# Altium schematic sheet Charger.SchDoc: Battery Charger
size A4; DrawnBy: Ricardo Rodrigues; Address1: ALCETRONICS; DocumentNumber: 2; Revision: 0v1; SheetNumber: 2; SheetTotal: 9
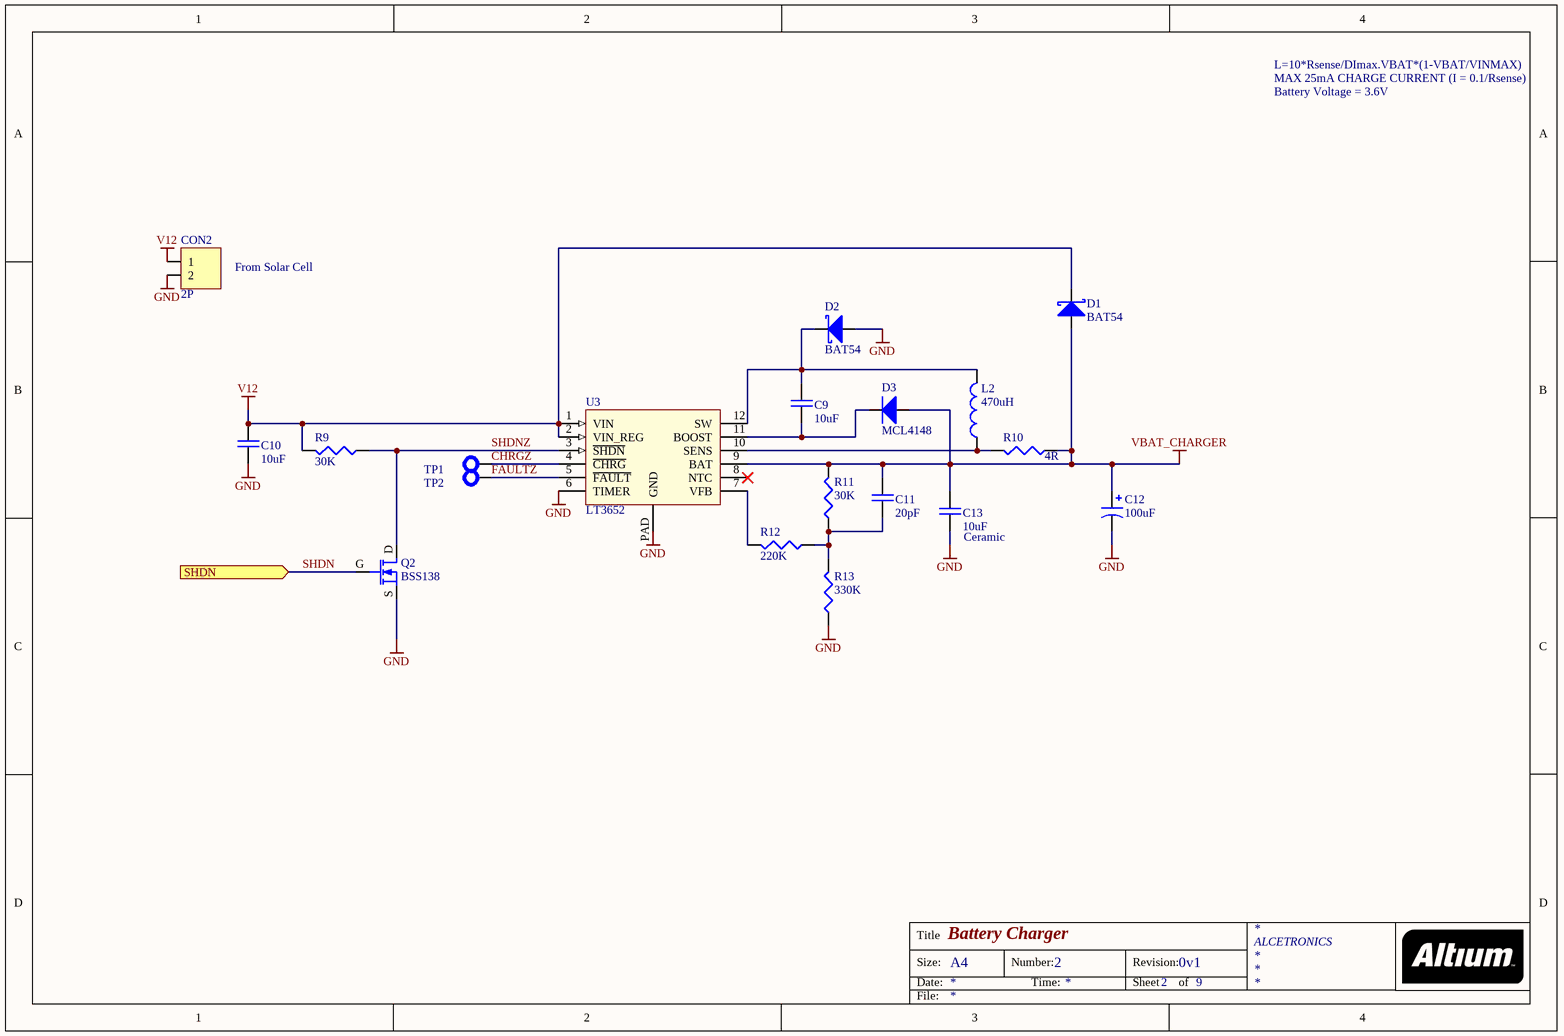
[diagram p0: Charger.SchDoc]

## Parts
C9  10uF  [0805]
C10  10uF  [0805]
C11  20pF  [0603]
C12  100uF  [RADIAL-5MM]
C13  10uF  [0805]
CON2  2P  [INTERLOCK2-5MM-FIXED]
D1  BAT54  [SOT-23@AK]
D2  BAT54  [SOT-23@AK]
D3  MCL4148  [0805@DIODE]
L2  470uH  [12X12]
Q2  BSS138  [SOT-23@GSD]
R9  30K  [0603]
R10  4R  [1206]
R11  30K  [0603]
R12  220K  [0603]
R13  330K  [0603]
TP1  Test Point  [TERMINAL]  (value not drawn)  (no BOM)
TP2  Test Point  [TERMINAL]  (value not drawn)  (no BOM)
U3  LT3652  [MSOP12@EP]

## Ports
SHDN (in)

## Nets
GND: C10.1 C12.2(N) C13.1 CON2.2 D2.A Q2.S R13.1 U3.6(TIMER) U3.PAD(GND)
V12: C10.2 CON2.1 D1.K R9.2 U3.1(VIN) U3.2(VIN_REG)
VBAT_CHARGER: C11.2 C12.1(P) C13.2 D1.A D3.A R10.1 R11.2 U3.9(BAT)
CHRGZ: TP1.1(TP) U3.4(~{CHRG})
FAULTZ: TP2.1(TP) U3.5(~{FAULT})
SHDN: Q2.G ; port SHDN
SHDNZ: Q2.D R9.1 U3.3(~{SHDN})
NetC9_1: C9.1 D3.K U3.11(BOOST)
NetC9_2: C9.2 D2.K L2.2 U3.12(SW)
NetC11_1: C11.1 R11.1 R12.1 R13.2
NetL2_1: L2.1 R10.2 U3.10(SENS)
NetR12_2: R12.2 U3.7(VFB)

Not connected (* = marked no-connect by the designer): U3 8(NTC)*

## Notes on the sheet
- MAX 25mA CHARGE CURRENT (I = 0.1/Rsense)
- Battery Voltage = 3.6V
- L=10*Rsense/DImax.VBAT*(1-VBAT/VINMAX)
- From Solar Cell
- (near C13) Ceramic
- Title
- Size:
- Date:
- A4
- Number:
- Time:
- Revision:
- Sheet
- of
- File:

## Library data of the parts
C9-C11 C13 = CAP: Capacitor; Owner: Nuno Brum; Sub-Type: Ceramic; Assembly: INS; Maximum Voltage: *; Creation Date: 2005-04-28; Status: Valid; Validation date: 2006-05-15; Type: Capacitor
C12 = CAP POL: Polarized Capacitor; Owner: Nuno Brum; Sub-Type: Tantalum; Assembly: INS; Validation date: 2006-05-15; Creation Date: 2005-04-28; Status: Valid; Type: Capacitor
CON2 = CON02: Connector 2 pins; Owner: Rui Rebelo; Assembly: INS; Sub-Type: Connector; Creation Date: 2005-05-27; Status: Valid; Validation Date: 2006-05-15; Type: Electrical & Mechanical
D1 D2 = Diode Schottky: Small Signal Schottky Diode; Owner: Nuno Brum; Assembly: INS; Validation date: 2006-05-15; Creation Date: 2001-06-05; Sub-Type: Schottky; Status: Valid; Model: BAT54; Type: Diode
D3 = Diode: Vishay Standard Avalanche Sinterglass Diode; Owner: Nuno Brum; Sub-Type: Generic; Assembly: INS; Validation date: 2006-05-15; Creation Date: 2001-06-05; Status: Valid; Model: MCL4148; Type: Diode
L2 = IND: Inductor; Owner: Nuno Brum; Sub-Type: Generic; Assembly: INS; Validation date: 2006-05-15; Creation Date: 2002-07-17; Status: Valid; Type: Inductor
Q2 = MOSFET-N: N-Channel Logic Level Enhancement Mode Field Effect Transistor; pin to pad: 2>3 3>2; Owner: Nuno Brum; Sub-Type: MOSFET; Assembly: INS; Creation Date: 2001-06-05; Status: Valid; Model: BSS138; Type: Transistor
R9-R13 = RES: Resistor; Owner: Nuno Brum; Sub-Type: Generic; Assembly: INS; Validation date: 2006-05-15; Creation Date: 2002-07-17; Status: Valid; Power: *; Type: Resistor
TP1 TP2 = TEST-PROBE: Test/Probe Point; Owner: Nuno Brum; Sub-Type: Mechanical; Assembly: PCB; Validation Date: 2006-05-15; Type: PCB; Creation Date: 2005-06-01; Status: Valid
U3 = LT3652: Power Tracking 2A Battery Charger for Solar Power; Type: IC; Creation Date: 2012-03-05